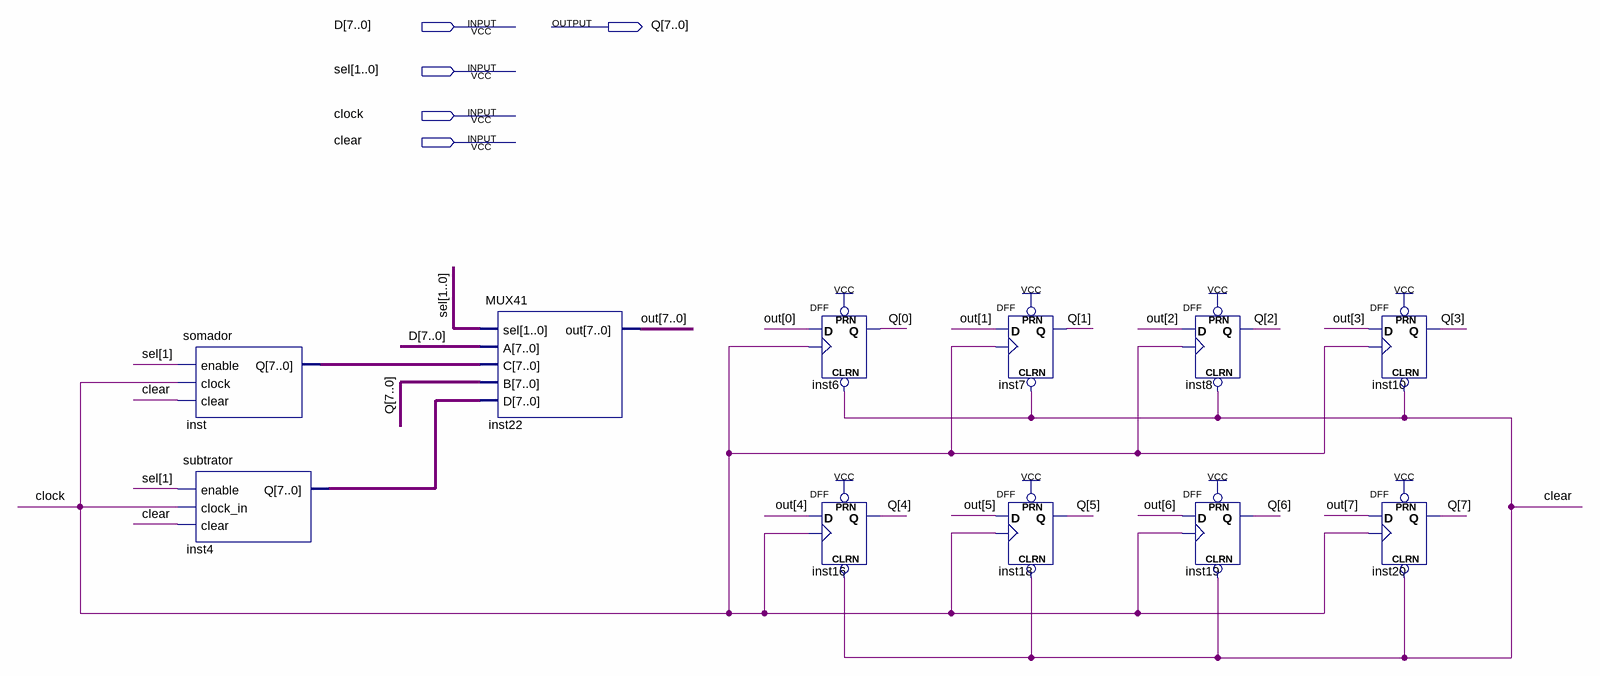
[diagram p0: schematic sheet]
// Quartus schematic Reg.bdf as structural Verilog: 11 symbols, 5 pins
module Reg (
  input  [7:0] D,
  input  [1:0] sel,
  input  clock,
  input  clear,
  output [7:0] Q
);

  wire [7:0] inst4_q, inst_q, out;

  somador inst (.enable(sel[1]), .clock(clock), .clear(clear), .Q(inst_q));
  subtrator inst4 (.enable(sel[1]), .clock_in(clock), .clear(clear), .Q(inst4_q));
  MUX41 inst22 (.sel(sel), .A(D), .C(inst_q), .B(Q), .D(inst4_q), .out(out));
  DFF inst6 (.CLRN(clear), .CLK(clock), .D(out[0]), .PRN(1'b1), .Q(Q[0]));
  DFF inst16 (.CLRN(clear), .CLK(clock), .D(out[4]), .PRN(1'b1), .Q(Q[4]));
  DFF inst7 (.CLRN(clear), .CLK(clock), .D(out[1]), .PRN(1'b1), .Q(Q[1]));
  DFF inst18 (.CLRN(clear), .CLK(clock), .D(out[5]), .PRN(1'b1), .Q(Q[5]));
  DFF inst8 (.CLRN(clear), .CLK(clock), .D(out[2]), .PRN(1'b1), .Q(Q[2]));
  DFF inst19 (.CLRN(clear), .CLK(clock), .D(out[6]), .PRN(1'b1), .Q(Q[6]));
  DFF inst10 (.CLRN(clear), .CLK(clock), .D(out[3]), .PRN(1'b1), .Q(Q[3]));
  DFF inst20 (.CLRN(clear), .CLK(clock), .D(out[7]), .PRN(1'b1), .Q(Q[7]));
endmodule
